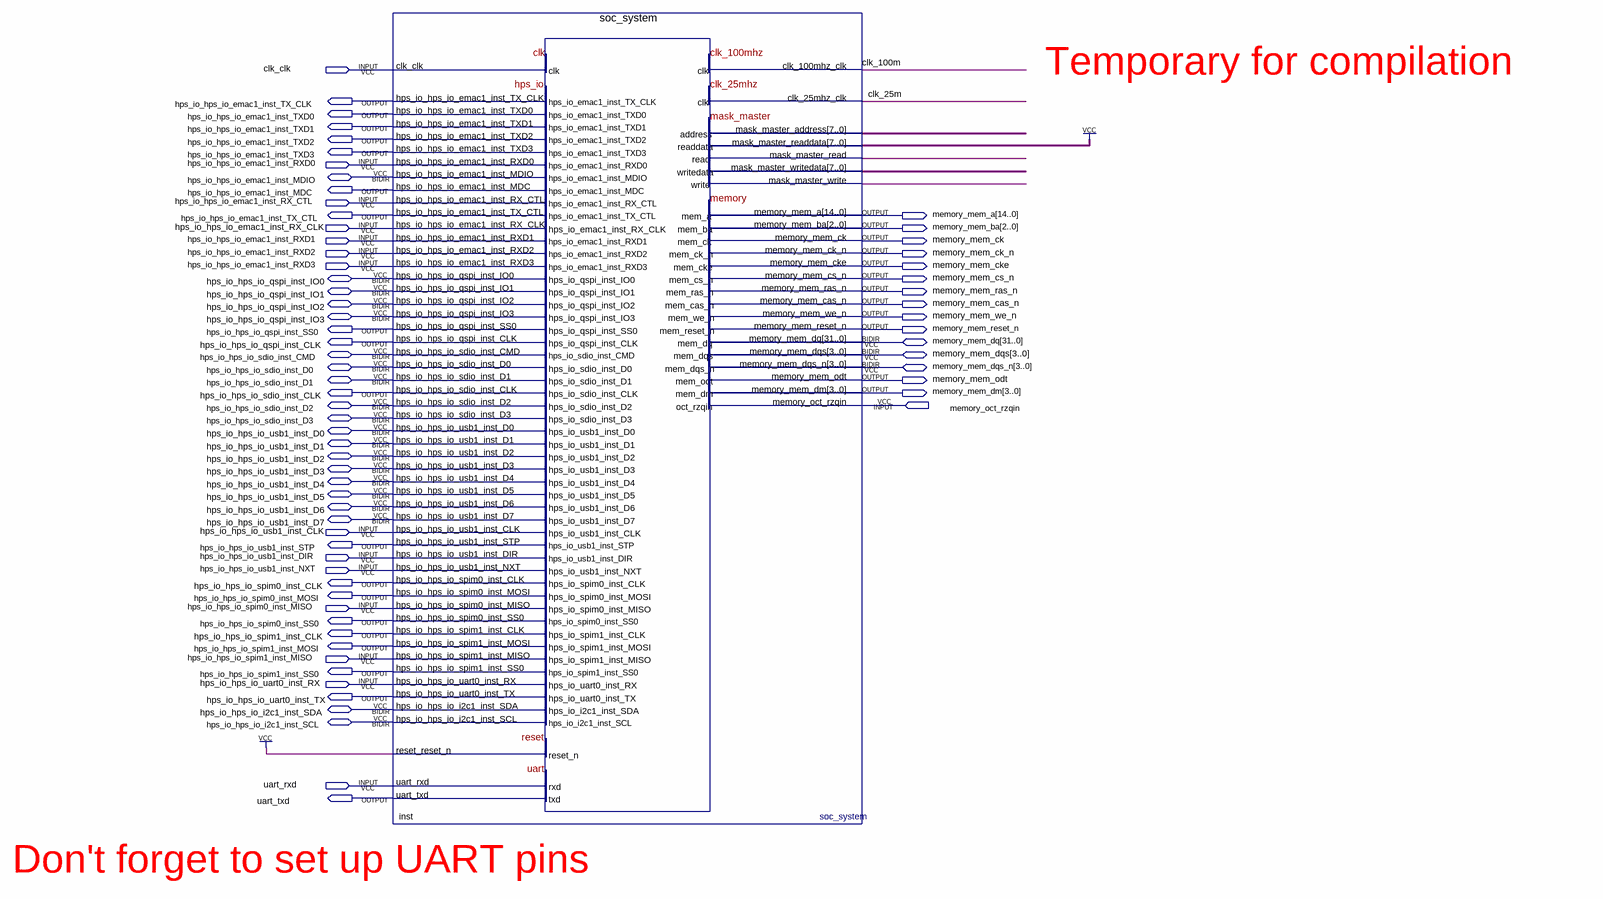
[diagram p0: schematic sheet]
// Quartus schematic main.bdf as structural Verilog: 1 symbols, 69 pins
module main (
  input  clk_clk,
  input  hps_io_hps_io_emac1_inst_RXD0,
  input  hps_io_hps_io_emac1_inst_RX_CTL,
  input  hps_io_hps_io_emac1_inst_RX_CLK,
  input  hps_io_hps_io_emac1_inst_RXD1,
  input  hps_io_hps_io_emac1_inst_RXD2,
  input  hps_io_hps_io_emac1_inst_RXD3,
  input  memory_oct_rzqin,
  input  hps_io_hps_io_usb1_inst_CLK,
  input  hps_io_hps_io_usb1_inst_DIR,
  input  hps_io_hps_io_usb1_inst_NXT,
  input  hps_io_hps_io_spim0_inst_MISO,
  input  hps_io_hps_io_spim1_inst_MISO,
  input  hps_io_hps_io_uart0_inst_RX,
  input  uart_rxd,
  inout  hps_io_hps_io_emac1_inst_MDIO,
  inout  hps_io_hps_io_qspi_inst_IO0,
  inout  hps_io_hps_io_qspi_inst_IO1,
  inout  hps_io_hps_io_qspi_inst_IO2,
  inout  hps_io_hps_io_qspi_inst_IO3,
  inout  [31:0] memory_mem_dq,
  inout  hps_io_hps_io_sdio_inst_CMD,
  inout  [3:0] memory_mem_dqs,
  inout  hps_io_hps_io_sdio_inst_D0,
  inout  [3:0] memory_mem_dqs_n,
  inout  hps_io_hps_io_sdio_inst_D1,
  inout  hps_io_hps_io_sdio_inst_D2,
  inout  hps_io_hps_io_sdio_inst_D3,
  inout  hps_io_hps_io_usb1_inst_D0,
  inout  hps_io_hps_io_usb1_inst_D1,
  inout  hps_io_hps_io_usb1_inst_D2,
  inout  hps_io_hps_io_usb1_inst_D3,
  inout  hps_io_hps_io_usb1_inst_D4,
  inout  hps_io_hps_io_usb1_inst_D5,
  inout  hps_io_hps_io_usb1_inst_D6,
  inout  hps_io_hps_io_usb1_inst_D7,
  inout  hps_io_hps_io_i2c1_inst_SDA,
  inout  hps_io_hps_io_i2c1_inst_SCL,
  output hps_io_hps_io_emac1_inst_TX_CLK,
  output hps_io_hps_io_emac1_inst_TXD0,
  output hps_io_hps_io_emac1_inst_TXD1,
  output hps_io_hps_io_emac1_inst_TXD2,
  output hps_io_hps_io_emac1_inst_TXD3,
  output hps_io_hps_io_emac1_inst_MDC,
  output hps_io_hps_io_emac1_inst_TX_CTL,
  output [14:0] memory_mem_a,
  output [2:0] memory_mem_ba,
  output memory_mem_ck,
  output memory_mem_ck_n,
  output memory_mem_cke,
  output memory_mem_cs_n,
  output memory_mem_ras_n,
  output memory_mem_cas_n,
  output memory_mem_we_n,
  output hps_io_hps_io_qspi_inst_SS0,
  output memory_mem_reset_n,
  output hps_io_hps_io_qspi_inst_CLK,
  output memory_mem_odt,
  output hps_io_hps_io_sdio_inst_CLK,
  output [3:0] memory_mem_dm,
  output hps_io_hps_io_usb1_inst_STP,
  output hps_io_hps_io_spim0_inst_CLK,
  output hps_io_hps_io_spim0_inst_MOSI,
  output hps_io_hps_io_spim0_inst_SS0,
  output hps_io_hps_io_spim1_inst_CLK,
  output hps_io_hps_io_spim1_inst_MOSI,
  output hps_io_hps_io_spim1_inst_SS0,
  output hps_io_hps_io_uart0_inst_TX,
  output uart_txd
);

  wire clk_25m, clk_100m, inst_mask_master_read, inst_mask_master_write;
  wire [7:0] inst_mask_master_address, inst_mask_master_writedata;

  soc_system inst (
    .clk_clk(clk_clk), .hps_io_hps_io_emac1_inst_RXD0(hps_io_hps_io_emac1_inst_RXD0),
    .hps_io_hps_io_emac1_inst_RX_CTL(hps_io_hps_io_emac1_inst_RX_CTL),
    .hps_io_hps_io_emac1_inst_RX_CLK(hps_io_hps_io_emac1_inst_RX_CLK),
    .hps_io_hps_io_emac1_inst_RXD1(hps_io_hps_io_emac1_inst_RXD1),
    .hps_io_hps_io_emac1_inst_RXD2(hps_io_hps_io_emac1_inst_RXD2),
    .hps_io_hps_io_emac1_inst_RXD3(hps_io_hps_io_emac1_inst_RXD3),
    .hps_io_hps_io_usb1_inst_CLK(hps_io_hps_io_usb1_inst_CLK),
    .hps_io_hps_io_usb1_inst_DIR(hps_io_hps_io_usb1_inst_DIR),
    .hps_io_hps_io_usb1_inst_NXT(hps_io_hps_io_usb1_inst_NXT),
    .hps_io_hps_io_spim0_inst_MISO(hps_io_hps_io_spim0_inst_MISO),
    .hps_io_hps_io_spim1_inst_MISO(hps_io_hps_io_spim1_inst_MISO),
    .hps_io_hps_io_uart0_inst_RX(hps_io_hps_io_uart0_inst_RX), .mask_master_readdata({8{1'b1}}),
    .memory_oct_rzqin(memory_oct_rzqin), .reset_reset_n(1'b1), .uart_rxd(uart_rxd),
    .clk_100mhz_clk(clk_100m), .clk_25mhz_clk(clk_25m),
    .hps_io_hps_io_emac1_inst_TX_CLK(hps_io_hps_io_emac1_inst_TX_CLK),
    .hps_io_hps_io_emac1_inst_TXD0(hps_io_hps_io_emac1_inst_TXD0),
    .hps_io_hps_io_emac1_inst_TXD1(hps_io_hps_io_emac1_inst_TXD1),
    .hps_io_hps_io_emac1_inst_TXD2(hps_io_hps_io_emac1_inst_TXD2),
    .hps_io_hps_io_emac1_inst_TXD3(hps_io_hps_io_emac1_inst_TXD3),
    .hps_io_hps_io_emac1_inst_MDC(hps_io_hps_io_emac1_inst_MDC),
    .hps_io_hps_io_emac1_inst_TX_CTL(hps_io_hps_io_emac1_inst_TX_CTL),
    .hps_io_hps_io_qspi_inst_SS0(hps_io_hps_io_qspi_inst_SS0),
    .hps_io_hps_io_qspi_inst_CLK(hps_io_hps_io_qspi_inst_CLK),
    .hps_io_hps_io_sdio_inst_CLK(hps_io_hps_io_sdio_inst_CLK),
    .hps_io_hps_io_usb1_inst_STP(hps_io_hps_io_usb1_inst_STP),
    .hps_io_hps_io_spim0_inst_CLK(hps_io_hps_io_spim0_inst_CLK),
    .hps_io_hps_io_spim0_inst_MOSI(hps_io_hps_io_spim0_inst_MOSI),
    .hps_io_hps_io_spim0_inst_SS0(hps_io_hps_io_spim0_inst_SS0),
    .hps_io_hps_io_spim1_inst_CLK(hps_io_hps_io_spim1_inst_CLK),
    .hps_io_hps_io_spim1_inst_MOSI(hps_io_hps_io_spim1_inst_MOSI),
    .hps_io_hps_io_spim1_inst_SS0(hps_io_hps_io_spim1_inst_SS0),
    .hps_io_hps_io_uart0_inst_TX(hps_io_hps_io_uart0_inst_TX),
    .mask_master_address(inst_mask_master_address), .mask_master_read(inst_mask_master_read),
    .mask_master_writedata(inst_mask_master_writedata), .mask_master_write(inst_mask_master_write),
    .memory_mem_a(memory_mem_a), .memory_mem_ba(memory_mem_ba), .memory_mem_ck(memory_mem_ck),
    .memory_mem_ck_n(memory_mem_ck_n), .memory_mem_cke(memory_mem_cke), .memory_mem_cs_n(memory_mem_cs_n),
    .memory_mem_ras_n(memory_mem_ras_n), .memory_mem_cas_n(memory_mem_cas_n),
    .memory_mem_we_n(memory_mem_we_n), .memory_mem_reset_n(memory_mem_reset_n),
    .memory_mem_odt(memory_mem_odt), .memory_mem_dm(memory_mem_dm), .uart_txd(uart_txd),
    .hps_io_hps_io_emac1_inst_MDIO(hps_io_hps_io_emac1_inst_MDIO),
    .hps_io_hps_io_qspi_inst_IO0(hps_io_hps_io_qspi_inst_IO0),
    .hps_io_hps_io_qspi_inst_IO1(hps_io_hps_io_qspi_inst_IO1),
    .hps_io_hps_io_qspi_inst_IO2(hps_io_hps_io_qspi_inst_IO2),
    .hps_io_hps_io_qspi_inst_IO3(hps_io_hps_io_qspi_inst_IO3),
    .hps_io_hps_io_sdio_inst_CMD(hps_io_hps_io_sdio_inst_CMD),
    .hps_io_hps_io_sdio_inst_D0(hps_io_hps_io_sdio_inst_D0),
    .hps_io_hps_io_sdio_inst_D1(hps_io_hps_io_sdio_inst_D1),
    .hps_io_hps_io_sdio_inst_D2(hps_io_hps_io_sdio_inst_D2),
    .hps_io_hps_io_sdio_inst_D3(hps_io_hps_io_sdio_inst_D3),
    .hps_io_hps_io_usb1_inst_D0(hps_io_hps_io_usb1_inst_D0),
    .hps_io_hps_io_usb1_inst_D1(hps_io_hps_io_usb1_inst_D1),
    .hps_io_hps_io_usb1_inst_D2(hps_io_hps_io_usb1_inst_D2),
    .hps_io_hps_io_usb1_inst_D3(hps_io_hps_io_usb1_inst_D3),
    .hps_io_hps_io_usb1_inst_D4(hps_io_hps_io_usb1_inst_D4),
    .hps_io_hps_io_usb1_inst_D5(hps_io_hps_io_usb1_inst_D5),
    .hps_io_hps_io_usb1_inst_D6(hps_io_hps_io_usb1_inst_D6),
    .hps_io_hps_io_usb1_inst_D7(hps_io_hps_io_usb1_inst_D7),
    .hps_io_hps_io_i2c1_inst_SDA(hps_io_hps_io_i2c1_inst_SDA),
    .hps_io_hps_io_i2c1_inst_SCL(hps_io_hps_io_i2c1_inst_SCL), .memory_mem_dq(memory_mem_dq),
    .memory_mem_dqs(memory_mem_dqs), .memory_mem_dqs_n(memory_mem_dqs_n));

  // Notes on the sheet:
  //   Temporary for compilation
  //   Don't forget to set up UART pins
endmodule
